# EAGLE design meca_2k10 (EAGLE 5.06)
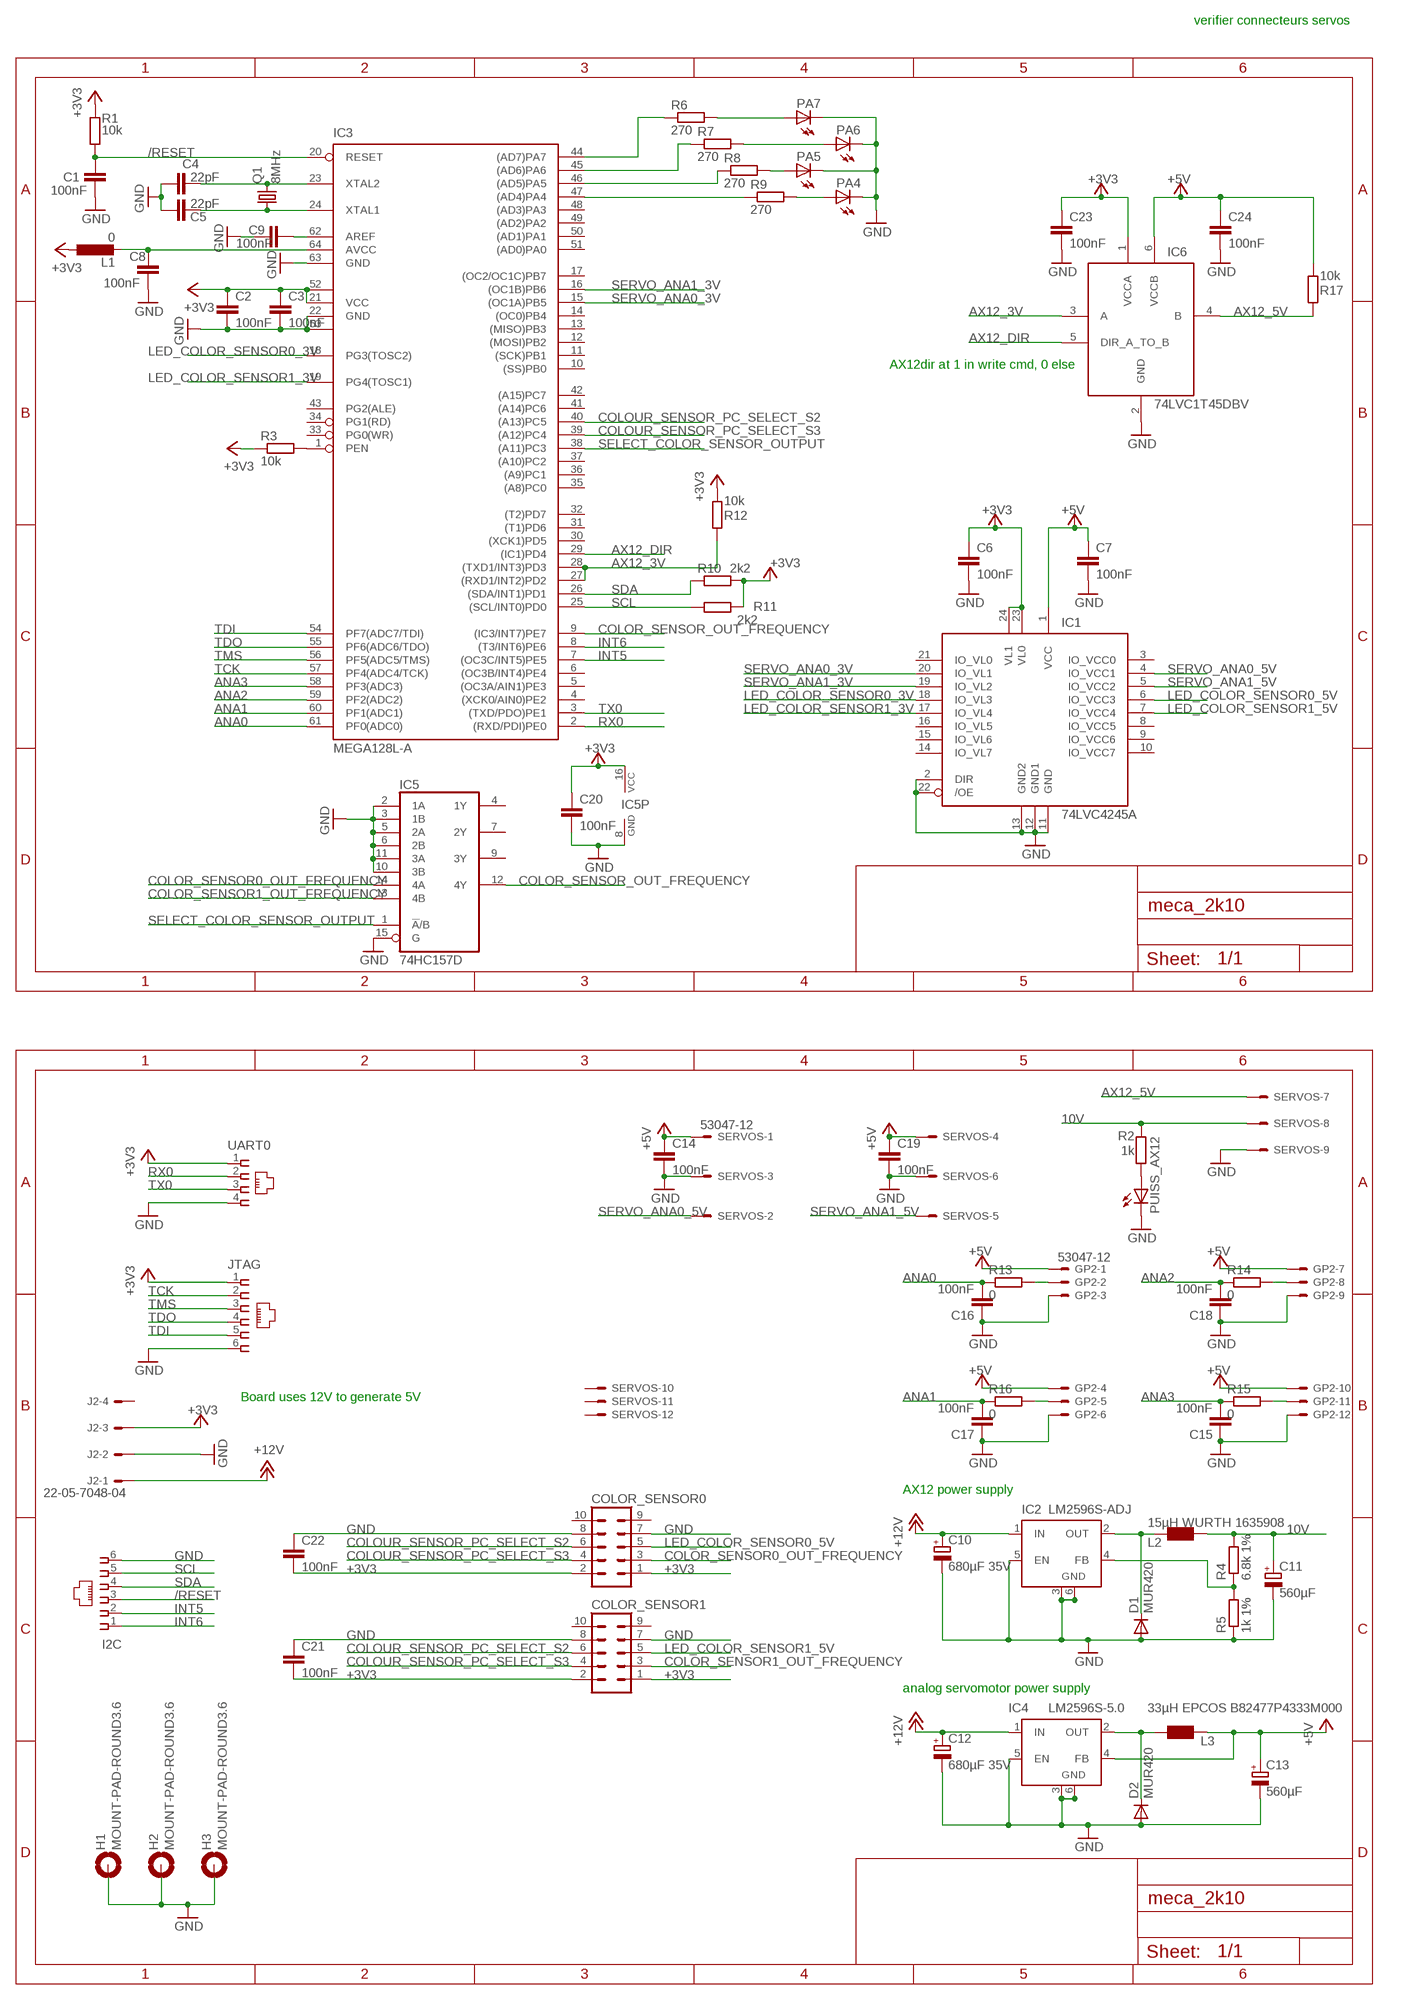
[diagram p0: schematic, sheet 1]

## Parts
C1  100nF  C-EU025-025X050  [C025-025X050]
C2  100nF  C-EUC0805  [C0805]
C3  100nF  C-EUC0805  [C0805]
C4  22pF  C-EUC0805  [C0805]
C5  22pF  C-EUC0805  [C0805]
C6  100nF  C-EU025-030X050  [C025-030X050]
C7  100nF  C-EU025-030X050  [C025-030X050]
C8  100nF  C-EUC0805  [C0805]
C9  100nF  C-EUC0805  [C0805]
C10  680µF 35V  CPOL-EUE5-10.5  [E5-10,5]
C11  560µF  CPOL-EUE5-10.5  [E5-10,5]
C12  680µF 35V  CPOL-EUE5-10.5  [E5-10,5]
C13  560µF  CPOL-EUE5-10.5  [E5-10,5]
C14  100nF  C-EU025-024X044  [C025-024X044]
C15  100nF  C-EUC0603  [C0603]
C16  100nF  C-EUC0603  [C0603]
C17  100nF  C-EUC0603  [C0603]
C18  100nF  C-EUC0603  [C0603]
C19  100nF  C-EU025-024X044  [C025-024X044]
C20  100nF  C-EUC0805  [C0805]
C21  100nF  C-EU050-025X075  [C050-025X075]
C22  100nF  C-EU050-025X075  [C050-025X075]
C23  100nF  C-EUC0603  [C0603]
C24  100nF  C-EUC0603  [C0603]
COLOR_SENSOR0  ML10L  [ML10L]
COLOR_SENSOR1  ML10L  [ML10L]
D1  MUR420  DIODE-DO201-15  [DO201-15]
D2  MUR420  DIODE-DO201-15  [DO201-15]
GP2  53047-12  [53047-12]
H1  MOUNT-PAD-ROUND3.6  [3,6-PAD]
H2  MOUNT-PAD-ROUND3.6  [3,6-PAD]
H3  MOUNT-PAD-ROUND3.6  [3,6-PAD]
I2C  520250-3  [520250-3]
IC1  74LVC4245A  [TSSOP24]
IC2  LM2596S-ADJ  LM2596S  [TO263-5]
IC3  MEGA128L-A  MEGA128-A  [TQFP64]
IC4  LM2596S-5.0  LM2596S  [TO263-5]
IC5  74HC157D  [SO16]
IC6  74LVC1T45DBV  [SOT23-6]
J2  22-05-7048-04  [7395-04]
JTAG  520250-3  [520250-3]
L1  0  L-EUL1812  [L1812]
L2  15µH WURTH 1635908  WE-PD_L/XL/XXL  [WE-PD_L/XL/XXL]
L3  33µH EPCOS B82477P4333M000  WE-PD_L/XL/XXL  [WE-PD_L/XL/XXL]
PA4  LEDCHIPLED_1206  [CHIPLED_1206]
PA5  LEDCHIPLED_1206  [CHIPLED_1206]
PA6  LEDCHIPLED_1206  [CHIPLED_1206]
PA7  LEDCHIPLED_1206  [CHIPLED_1206]
PUISS_AX12  LEDCHIPLED_1206  [CHIPLED_1206]
Q1  8MHz  CRYSTALHC49S  [HC49/S]
R1  10k  R-EU_0207/10  [0207/10]
R2  1k  R-EU_R0805  [R0805]
R3  10k  R-EU_0207/10  [0207/10]
R4  6.8k 1%  R-EU_R0805  [R0805]
R5  1k 1%  R-EU_R0805  [R0805]
R6  270  R-EU_R0805  [R0805]
R7  270  R-EU_R0805  [R0805]
R8  270  R-EU_R0805  [R0805]
R9  270  R-EU_R0805  [R0805]
R10  2k2  R-EU_R0805  [R0805]
R11  2k2  R-EU_R0805  [R0805]
R12  10k  R-EU_R0805  [R0805]
R13  0  R-EU_R0805  [R0805]
R14  0  R-EU_R0805  [R0805]
R15  0  R-EU_R0805  [R0805]
R16  0  R-EU_R0805  [R0805]
R17  10k  R-EU_R0805  [R0805]
SERVOS  53047-12  [53047-12]
UART0  555165-2  [555165-2]

## Nets
10V: C11.+ L2.1 R2.2 R4.2 SERVOS.8
+3V3: C2.1 C3.1 C6.1 C20.1 C21.2 C22.2 C23.1 COLOR_SENSOR0.1 COLOR_SENSOR0.2 COLOR_SENSOR1.1 COLOR_SENSOR1.2 IC1.23(VL0) IC1.24(VL1) IC3.21(VCC) IC3.52(VCC1) IC5.16(VCC) IC6.1(VCCA) J2.3 JTAG.1 L1.1 R1.2 R3.1 R10.1 R11.1 R12.1 UART0.1
+5V: C7.1 C13.+ C14.1 C19.1 C24.1 GP2.1 GP2.4 GP2.7 GP2.10 IC1.1(VCC) IC4.4(FB) IC6.6(VCCB) L3.1 R17.1 SERVOS.1 SERVOS.4
+12V: C10.+ C12.+ IC2.1(IN) IC4.1(IN) J2.1
/RESET: C1.1 I2C.3 IC3.20(RESET) R1.1
ANA0: C16.2 IC3.61(PF0(ADC0)) R13.1
ANA1: C17.2 IC3.60(PF1(ADC1)) R16.1
ANA2: C18.2 IC3.59(PF2(ADC2)) R14.1
ANA3: C15.2 IC3.58(PF3(ADC3)) R15.1
AX12_3V: IC3.27((RXD1/INT2)PD2) IC3.28((TXD1/INT3)PD3) IC6.3(A) R12.2
AX12_5V: IC6.4(B) R17.2 SERVOS.7
AX12_DIR: IC3.29((IC1)PD4) IC6.5(DIR_A_TO_B)
COLOR_SENSOR0_OUT_FREQUENCY: COLOR_SENSOR0.3 IC5.14(4A)
COLOR_SENSOR1_OUT_FREQUENCY: COLOR_SENSOR1.3 IC5.13(4B)
COLOR_SENSOR_OUT_FREQUENCY: IC3.9((IC3/INT7)PE7) IC5.12(4Y)
COLOUR_SENSOR_PC_SELECT_S2: COLOR_SENSOR0.6 COLOR_SENSOR1.6 IC3.40((A13)PC5)
COLOUR_SENSOR_PC_SELECT_S3: COLOR_SENSOR0.4 COLOR_SENSOR1.4 IC3.39((A12)PC4)
GND: C1.2 C2.2 C3.2 C4.1 C5.1 C6.2 C7.2 C8.2 C9.1 C10.- C11.- C12.- C13.- C14.2 C15.1 C16.1 C17.1 C18.1 C19.2 C20.2 C21.1 C22.1 C23.2 C24.2 COLOR_SENSOR0.7 COLOR_SENSOR0.8 COLOR_SENSOR1.7 COLOR_SENSOR1.8 D1.A D2.A GP2.3 GP2.6 GP2.9 GP2.12 H1.B3,6(MOUNT) H2.B3,6(MOUNT) H3.B3,6(MOUNT) I2C.6 IC1.2(DIR) IC1.11(GND) IC1.12(GND1) IC1.13(GND2) IC1.22(/OE) IC2.3(GND) IC2.5(EN) IC2.6(GND) IC3.22(GND) IC3.53(GND1) IC3.63(GND) IC4.3(GND) IC4.5(EN) IC4.6(GND) IC5.2(1A) IC5.3(1B) IC5.5(2A) IC5.6(2B) IC5.8(GND) IC5.10(3B) IC5.11(3A) IC5.15(G) IC6.2(GND) J2.2 JTAG.6 PA4.C PA5.C PA6.C PA7.C PUISS_AX12.C R5.1 SERVOS.3 SERVOS.6 SERVOS.9 UART0.4
INT5: I2C.2 IC3.7((OC3C/INT5)PE5)
INT6: I2C.1 IC3.8((T3/INT6)PE6)
LED_COLOR_SENSOR0_3V: IC1.18(IO_VL3) IC3.18(PG3(TOSC2))
LED_COLOR_SENSOR0_5V: COLOR_SENSOR0.5 IC1.6(IO_VCC3)
LED_COLOR_SENSOR1_3V: IC1.17(IO_VL4) IC3.19(PG4(TOSC1))
LED_COLOR_SENSOR1_5V: COLOR_SENSOR1.5 IC1.7(IO_VCC4)
N$1: C4.2 IC3.23(XTAL2) Q1.2
N$2: C5.2 IC3.24(XTAL1) Q1.1
N$3: IC3.47((AD4)PA4) R9.1
N$4: IC3.1(PEN) R3.2
N$5: C8.1 IC3.64(AVCC) L1.2
N$6: C9.2 IC3.62(AREF)
N$7: GP2.11 R15.2
N$8: D1.C IC2.2(OUT) L2.2
N$9: IC2.4(FB) R4.1 R5.2
N$10: IC3.46((AD5)PA5) R8.1
N$11: D2.C IC4.2(OUT) L3.2
N$12: GP2.2 R13.2
N$13: GP2.5 R16.2
N$14: PUISS_AX12.A R2.1
N$15: GP2.8 R14.2
N$17: IC3.45((AD6)PA6) R7.1
N$18: PA4.A R9.2
N$19: PA5.A R8.2
N$20: PA6.A R7.2
N$21: PA7.A R6.2
N$22: IC3.44((AD7)PA7) R6.1
RX0: IC3.2((RXD/PDI)PE0) UART0.2
SCL: I2C.5 IC3.25((SCL/INT0)PD0) R11.2
SDA: I2C.4 IC3.26((SDA/INT1)PD1) R10.2
SELECT_COLOR_SENSOR_OUTPUT: IC3.38((A11)PC3) IC5.1(!A!/B)
SERVO_ANA0_3V: IC1.20(IO_VL1) IC3.15((OC1A)PB5)
SERVO_ANA0_5V: IC1.4(IO_VCC1) SERVOS.2
SERVO_ANA1_3V: IC1.19(IO_VL2) IC3.16((OC1B)PB6)
SERVO_ANA1_5V: IC1.5(IO_VCC2) SERVOS.5
TCK: IC3.57(PF4(ADC4/TCK)) JTAG.2
TDI: IC3.54(PF7(ADC7/TDI)) JTAG.5
TDO: IC3.55(PF6(ADC6/TDO)) JTAG.4
TMS: IC3.56(PF5(ADC5/TMS)) JTAG.3
TX0: IC3.3((TXD/PDO)PE1) UART0.3
Unconnected: COLOR_SENSOR0.9 COLOR_SENSOR0.10 COLOR_SENSOR1.9 COLOR_SENSOR1.10 IC1.3(IO_VCC0) IC1.8(IO_VCC5) IC1.9(IO_VCC6) IC1.10(IO_VCC7) IC1.14(IO_VL7) IC1.15(IO_VL6) IC1.16(IO_VL5) IC1.21(IO_VL0) IC3.4((XCK0/AIN0)PE2) IC3.5((OC3A/AIN1)PE3) IC3.6((OC3B/INT4)PE4) IC3.10((SS)PB0) IC3.11((SCK)PB1) IC3.12((MOSI)PB2) IC3.13((MISO)PB3) IC3.14((OC0)PB4) IC3.17((OC2/OC1C)PB7) IC3.30((XCK1)PD5) IC3.31((T1)PD6) IC3.32((T2)PD7) IC3.33(PG0(WR)) IC3.34(PG1(RD)) IC3.35((A8)PC0) IC3.36((A9)PC1) IC3.37((A10)PC2) IC3.41((A14)PC6) IC3.42((A15)PC7) IC3.43(PG2(ALE)) IC3.48((AD3)PA3) IC3.49((AD2)PA2) IC3.50((AD1)PA1) IC3.51((AD0)PA0) IC5.4(1Y) IC5.7(2Y) IC5.9(3Y) J2.4 SERVOS.10 SERVOS.11 SERVOS.12

## Notes on the sheet
- verifier connecteurs servos
- AX12dir at 1 in write cmd, 0 else
- Board uses 12V to generate 5V
- AX12 power supply
- analog servomotor power supply

## Library data of the parts
C1-C9 C14-C24 = rcl:C-EU: CAPACITOR, European symbol
C10-C13 = rcl:CPOL-EU: POLARIZED CAPACITOR, European symbol
COLOR_SENSOR0 COLOR_SENSOR1 = con-harting-ml:ML10: HARTING
D1 D2 = diode:DIODE-: DIODE
GP2 SERVOS = con-molex:53?-12: CONNECTOR wire to board 1.25 mm (.049 inch) pitch header
H1-H3 = holes:MOUNT-PAD-ROUND: MOUNTING PAD, round
I2C JTAG = con-amp:520250-3: AMP connector
IC1 = robotter:74LVC4245: octal transceiver buffer
IC2 IC4 = linear:LM2596S: STEP-DOWN VOLTAGE REGULATOR
IC3 = atmel:MEGA128: MICROCONTROLLER 128 Kbytes FLASH 4 Kbytes SRAM 4 Kbytes EEPROM DUAL USART 8-channel 10 bit ADC Source: avr.lbr
IC5 = 74xx-eu:74*157: Quadruple 2-line to 1-line data SELECTOR/MULTIPLEXER
IC6 = robotter:74LVC1T45
J2 = con-molex:22-?-04: CONNECTOR wire to board 2.54 mm (.1 inch) pitch header
L1 = rcl:L-EU: INDUCTOR, European symbol
L2 L3 = wuerth-elektronik:WE-PD: SMD-Shielded Power Inductors WE-PD Is recommended for the application with switching regulators from National Semiconductor, Linear Technology, Texas Instruments and Fairchild Semiconductor - Magnetically shielded version which results in a low leakage field - High storage capacity - Low self-losses -- Switching regulators with low operating voltages (computer, laptop, mobile phones, pagers) -- Integrated DC/DC-converter
PA4-PA7 PUISS_AX12 = led:LED: LED OSRAM: - CHIPLED LG R971, LG N971, LY N971, LG Q971, LY Q971, LO R971, LY R971 LH N974, LH R974 LS Q976, LO Q976, LY Q976 LO Q996 - Hyper CHIPLED LW Q18S LB Q993, LB Q99A, LB R99A - SideLED LS A670, LO A670, LY A670, LG A670, LP A670 LB A673, LV A673, LT A673, LW A673 LH A674 LY A675 LS A676, LA A676, LO A676, LY A676, LW A676 LS A679, LY A679, LG A679 - Hyper Micro SIDELED® LS Y876, LA Y876, LO Y876, LY Y876 LT Y87S - SmartLED LW L88C, LW L88S LB L89C, LB L89S, LG L890 LS L89K, LO L89K, LY L89K LS L896, LA L896, LO L896, LY L896 - TOPLED LS T670, LO T670, LY T670, LG T670, LP T670 LSG T670, LSP T670, LSY T670, LOP T670, LYG T670 LG T671, LOG T671, LSG T671 LB T673, LV T673, LT T673, LW T673 LH T674 LS T676, LA T676, LO T676, LY T676, LB T676, LH T676, LSB T676, LW T676 LB T67C, LV T67C, LT T67C, LS T67K, LO T67K, LY T67K, LW E67C LS E67B, LA E67B, LO E67B, LY E67B, LB E67C, LV E67C, LT E67C LW T67C LS T679, LY T679, LG T679 LS T770, LO T770, LY T770, LG T770, LP T770 LB T773, LV T773, LT T773, LW T773 LH T774 LS E675, LA E675, LY E675, LS T675 LS T776, LA T776, LO T776, LY T776, LB T776 LHGB T686 LT T68C, LB T68C - Hyper Mini TOPLED® LB M676 - Mini TOPLED Santana® LG M470 LS M47K, LO M47K, LY M47K Source: http://www.osram.convergy.de LUXEON: - LUMILED® LXK2-PW12-R00, LXK2-PW12-S00, LXK2-PW14-U00, LXK2-PW14-V00 LXK2-PM12-R00, LXK2-PM12-S00, LXK2-PM14-U00 LXK2-PE12-Q00, LXK2-PE12-R00, LXK2-PE12-S00, LXK2-PE14-T00, LXK2-PE14-U00 LXK2-PB12-K00, LXK2-PB12-L00, LXK2-PB12-M00, LXK2-PB14-N00, LXK2-PB14-P00, LXK2-PB14-Q00 LXK2-PR12-L00, LXK2-PR12-M00, LXK2-PR14-Q00, LXK2-PR14-R00 LXK2-PD12-Q00, LXK2-PD12-R00, LXK2-PD12-S00 LXK2-PH12-R00, LXK2-PH12-S00 LXK2-PL12-P00, LXK2-PL12-Q00, LXK2-PL12-R00 Source: www.luxeon.com KINGBRIGHT: KA-3528ASYC Source: www.kingbright.com
Q1 = crystal:CRYSTAL: CRYSTAL
R1-R17 = rcl:R-EU_: RESISTOR, European symbol
UART0 = con-amp:555165-2: AMP connector

## Board
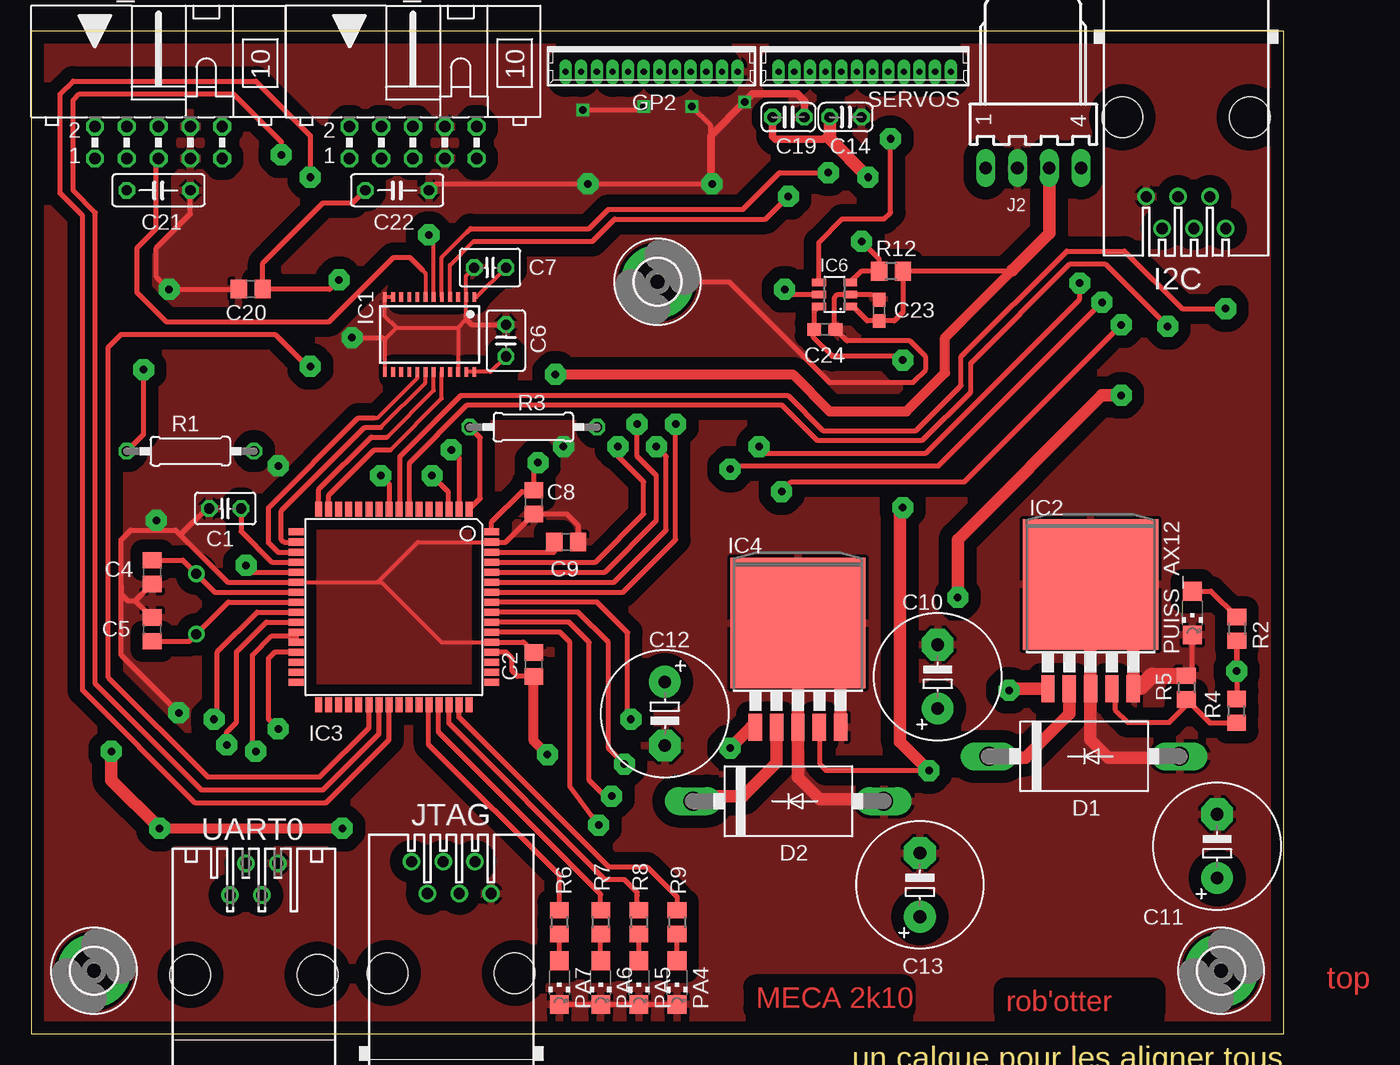
[diagram p1: board, top side]
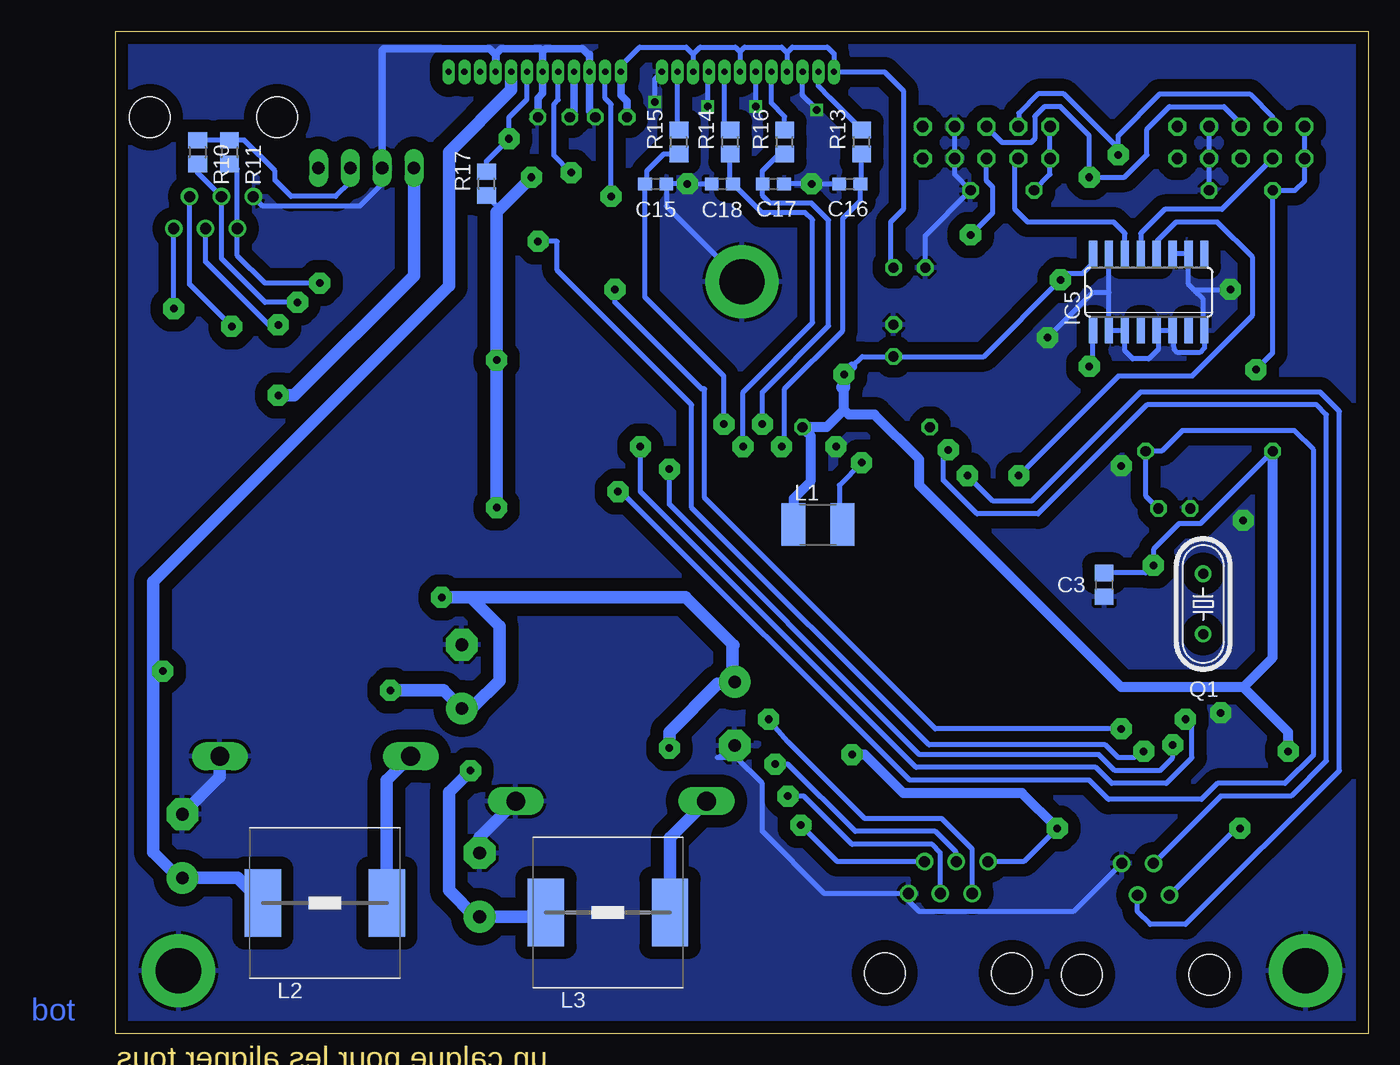
[diagram p2: board, bottom side, seen from below]

Size 100 x 80 mm. Coordinates in mm from the lower left corner, seen from the top.
Outline: 0,0 100,0 100,80 0,80 0,0
Copper layers (1*16): Top 0.035mm / dielectric 1.5mm / Bottom 0.035mm
Design rules "default *": minimum track width 10mil, minimum drill 0.0152mm, track to track 1mm, track to pad 1mm, pad to pad 1mm, via to via 8mil, smd to smd 8mil, copper to edge 1mm, drill to drill 8mil, minimum pad ring 10mil, minimum via ring 8mil, stop-mask expansion 4mil, vias tented up to drill 0mil, thermal gap 10mil

### Footprints (pad centres in the part's own frame; a part is rotated, then mirrored left to right if it is on the bottom)
C025-025X050 = drill 0.813 octagon: 1 -1.27,0; 2 1.27,0
C0805 = smd 1.3 x 1.5: 1 -0.95,0; 2 0.95,0
C025-030X050 = drill 0.813 octagon: 1 -1.27,0; 2 1.27,0
E5-10,5 = drill 1.016 pad 2.54 round: + -2.54,0 | drill 1.016 pad 2.54 octagon: - 2.54,0
C025-024X044 = drill 0.813 octagon: 1 -1.27,0; 2 1.27,0
C0603 = smd 1.1 x 1: 1 -0.85,0; 2 0.85,0
C050-025X075 = drill 0.813 octagon: 1 -2.54,0; 2 2.54,0
ML10L = drill 0.914 octagon: 1 -5.08,-1.27; 2 -5.08,1.27; 3 -2.54,-1.27; 4 -2.54,1.27; 5 0,-1.27; 6 0,1.27; 7 2.54,-1.27; 8 2.54,1.27; 9 5.08,-1.27; 10 5.08,1.27
DO201-15 = drill 1.499 long: A 7.62,0; C -7.62,0
53047-12 = drill 0.5 pad 0.698 long: 1 6.875,0.45; 2 5.625,0.45; 3 4.375,0.45; 4 3.125,0.45; 5 1.875,0.45; 6 0.625,0.45; 7 -0.625,0.45; 8 -1.875,0.45; 9 -3.125,0.45; 10 -4.375,0.45; 11 -5.625,0.45; 12 -6.875,0.45
3,6-PAD = drill 3.6 pad 5.842 round: B3,6 0,0
520250-3 = drill 0.889 round: 1 -3.175,8.89; 2 -1.905,6.35; 3 -0.635,8.89; 4 0.635,6.35; 5 1.905,8.89; 6 3.175,6.35 | hole 3.251: -5.08,0; 5.08,0
TSSOP24 = smd 0.3 x 0.75: 1 -3.575,-3; 2 -2.925,-3; 3 -2.275,-3; 4 -1.625,-3; 5 -0.975,-3; 6 -0.325,-3; 7 0.325,-3; 8 0.975,-3; 9 1.625,-3; 10 2.275,-3; 11 2.925,-3; 12 3.575,-3; 13 3.575,3; 14 2.925,3; 15 2.275,3; 16 1.625,3; 17 0.975,3; 18 0.325,3; 19 -0.325,3; 20 -0.975,3; 21 -1.625,3; 22 -2.275,3; 23 -2.925,3; 24 -3.575,3
TO263-5 = smd 1.067 x 2.159: 1 -3.404,-5.791; 2 -1.702,-5.791; 3 0,-5.791; 4 1.702,-5.791; 5 3.404,-5.791 | smd 10.8 x 10.41: 6 0,2.54
TQFP64 = smd 1.194 x 0.559: 1 -7.8,6; 2 -7.8,5.2; 3 -7.8,4.4; 4 -7.8,3.6; 5 -7.8,2.8; 6 -7.8,2; 7 -7.8,1.2; 8 -7.8,0.4; 9 -7.8,-0.4; 10 -7.8,-1.2; 11 -7.8,-2; 12 -7.8,-2.8; 13 -7.8,-3.6; 14 -7.8,-4.4; 15 -7.8,-5.2; 16 -7.8,-6; 33 7.8,-6; 34 7.8,-5.2; 35 7.8,-4.4; 36 7.8,-3.6; 37 7.8,-2.8; 38 7.8,-2; 39 7.8,-1.2; 40 7.8,-0.4; 41 7.8,0.4; 42 7.8,1.2; 43 7.8,2; 44 7.8,2.8; 45 7.8,3.6; 46 7.8,4.4; 47 7.8,5.2; 48 7.8,6 | smd 0.559 x 1.194: 17 -6,-7.8; 18 -5.2,-7.8; 19 -4.4,-7.8; 20 -3.6,-7.8; 21 -2.8,-7.8; 22 -2,-7.8; 23 -1.2,-7.8; 24 -0.4,-7.8; 25 0.4,-7.8; 26 1.2,-7.8; 27 2,-7.8; 28 2.8,-7.8; 29 3.6,-7.8; 30 4.4,-7.8; 31 5.2,-7.8; 32 6,-7.8; 49 6,7.8; 50 5.2,7.8; 51 4.4,7.8; 52 3.6,7.8; 53 2.8,7.8; 54 2,7.8; 55 1.2,7.8; 56 0.4,7.8; 57 -0.4,7.8; 58 -1.2,7.8; 59 -2,7.8; 60 -2.8,7.8; 61 -3.6,7.8; 62 -4.4,7.8; 63 -5.2,7.8; 64 -6,7.8
SO16 = smd 0.66 x 2.032: 1 -4.445,-3.073; 2 -3.175,-3.073; 3 -1.905,-3.073; 4 -0.635,-3.073; 5 0.635,-3.073; 6 1.905,-3.073; 7 3.175,-3.073; 8 4.445,-3.073; 9 4.445,3.073; 10 3.175,3.073; 11 1.905,3.073; 12 0.635,3.073; 13 -0.635,3.073; 14 -1.905,3.073; 15 -3.175,3.073; 16 -4.445,3.073
SOT23-6 = smd 0.6 x 1.1: 1 -0.95,-1.25; 2 0,-1.25; 3 0.95,-1.25; 4 0.95,1.25; 5 0,1.25; 6 -0.95,1.25
7395-04 = drill 1.016 long: 1 3.81,0; 2 1.27,0; 3 -1.27,0; 4 -3.81,0
L1812 = smd 1.9 x 3.4: 1 -1.95,0; 2 1.95,0
WE-PD_L/XL/XXL = smd 2.9 x 5.4: 1 -4.95,0; 2 4.95,0
CHIPLED_1206 = smd 1.5 x 1.5: A 0,-1.75; C 0,1.75
HC49/S = drill 0.813 round: 1 -2.413,0; 2 2.413,0
0207/10 = drill 0.813 octagon: 1 -5.08,0; 2 5.08,0
R0805 = smd 1.3 x 1.5: 1 -0.95,0; 2 0.95,0
555165-2 = drill 0.889 round: 1 -1.905,5.207; 2 -0.635,7.747; 3 0.635,5.207; 4 1.905,7.747 | hole 3.251: -5.08,-1.143; 5.08,-1.143

### Placement (x,y rotation side)
C1  15.48,41.91 180 top
C2  40.12,29.46 90 top
C3  21.08,35.81 270 bottom
C4  9.65,36.83 90 top
C5  9.65,32.26 270 top
C6  37.9,55.31 90 top
C7  36.63,61.14 180 top
C8  40.13,42.42 270 top
C9  42.72,39.24 180 top
C10  72.38,28.49 90 top
C11  94.69,14.96 90 top
C12  50.59,25.53 270 top
C13  70.96,11.87 90 top
C14  65.02,73.15 0 top
C15  56.9,67.82 180 bottom
C16  41.39,67.82 0 bottom
C17  47.5,67.82 180 bottom
C18  51.56,67.82 0 bottom
C19  60.45,73.15 0 top
C20  17.53,59.44 180 top
C21  10.16,67.31 180 top
C22  29.21,67.31 180 top
C23  67.69,57.73 90 top
C24  63.37,56.21 0 top
COLOR_SENSOR0  30.48,71.12 0 top
COLOR_SENSOR1  10.16,71.12 0 top
D1  84.07,22.12 0 top
D2  60.45,18.54 0 top
GP2  49.53,77.21 180 top
H1  5,5 0 top
H2  50,60 0 top
H3  95,5 0 top
I2C  92.2,73.15 180 top
IC1  31.81,55.81 180 top
IC2  84.58,33.3 0 top
IC3  28.96,34.04 270 top
IC4  61.22,30.23 0 top
IC5  17.53,59.18 0 bottom
IC6  64.13,59 90 top
J2  80.01,69.09 180 top
JTAG  33.53,4.83 0 top
L1  43.93,40.63 0 bottom
L2  83.31,10.41 0 bottom
L3  60.71,9.65 0 bottom
PA4  51.56,4.07 180 top
PA5  48.51,4.07 180 top
PA6  45.47,4.07 180 top
PA7  42.16,4.07 180 top
PUISS_AX12  92.71,33.57 180 top
Q1  13.17,34.29 90 bottom
R1  12.7,46.48 180 top
R2  96.27,32.3 270 top
R3  40.09,48.41 180 top
R4  96.24,25.75 90 top
R5  92.23,27.61 270 top
R6  42.16,8.89 270 top
R7  45.47,8.89 270 top
R8  48.51,8.89 270 top
R9  51.56,8.89 270 top
R10  93.47,70.36 270 bottom
R11  90.93,70.36 270 bottom
R12  68.65,60.84 180 top
R13  40.45,71.17 90 bottom
R14  50.94,71.17 90 bottom
R15  55.04,71.17 90 bottom
R16  46.59,71.17 90 bottom
R17  70.4,67.84 90 bottom
SERVOS  66.55,77.21 180 top
UART0  17.78,5.84 0 top

### Tracks (layer width: path | path; a pad name or v marks a point on that pad's centre or on a via)
10V  (via drill 0.6 pad 1.68)
  Top 0.406: R4.2 96.27,26.73 R2.2 v96.27,28.94 v96.26,28.93
  Bottom 0.406: v96.26,28.93 96.77,28.93 97.03,28.67
  Bottom 0.61: SERVOS.8 68.42,75.85
  Bottom 1.016: SERVOS.8 68.42,75.34 73.41,70.36 73.41,59.69 97.03,36.07 97.03,28.67 97.03,14.48 95.27,12.72 C11.+ 90.27,12.42 L2.1
+3V3  (via drill 0.6 pad 1.68)
  Top 0.305: IC1.23 IC1.24 36.67,52.81 C6.1
  Top 0.406: IC6.1 65.59,58.05 66.76,56.88 C23.1 68.91,56.88 69.6,57.56 R12.1 78.25,60.84 78.34,60.93 | v24.58,60.16 23.81,59.39 18.52,59.39 C20.1 18.48,61.48 23.3,66.3 25.66,66.3 C22.2 | IC3.21 17.69,36.84 v17.15,37.38 | IC3.52 37.92,30.44 38.4,29.95 38.4,28.93 38.82,28.51 C2.1 | v8.96,52.99 8.96,47.82 R1.2
  Top 0.813: 78.34,60.93 72.96,55.55 72.96,52.74 69.89,49.66 63.74,49.66 60.8,52.61 v41.86,52.61 | v10.24,16.38 v24.83,16.38 | C2.1 40.12,23.37 v41.22,22.27
  Top 1.016: J2.3 81.28,63.87 78.34,60.93 | v10.24,16.38 6.4,20.22 v6.4,22.53
  Bottom 0.406: R10.1 R11.1 89.74,71.31 87.3,68.86 87.3,68.1 86.02,66.82 82.43,66.82 81.28,67.97 J2.3 | COLOR_SENSOR0.2 COLOR_SENSOR0.1 25.4,68.58 C22.2 | COLOR_SENSOR1.2 COLOR_SENSOR1.1 5.08,68.07 5.84,67.31 C21.2 7.62,54.33 v8.96,52.99 | IC5.16 21.97,61.48 22.78,60.67 24.06,60.67 v24.58,60.16 30.7,54.04 C6.1 40.42,54.04 41.22,53.25 | C3.1 17.76,36.76 v17.15,37.38 17.15,38.66 15.1,40.7 13.4,40.7 R1.2 | UART0.1 10.54,16.38 v10.24,16.38 | JTAG.1 27.5,13.72 v24.83,16.38 | R3.1 44.8,48.04
  Bottom 0.813: v41.86,52.61 41.22,53.25 | 44.8,48.04 44.54,47.78 44.54,44.03 45.88,42.69 L1.1 | R1.2 7.62,30.01 9.98,27.65 | 41.86,49.79 41.86,51.58 | 9.98,27.65 18.43,27.65 19.71,27.65 35.84,43.78 35.84,45.82 39.42,49.41 41.47,49.41 41.86,49.79 | v6.4,22.53 6.4,24.06 9.98,27.65 | 41.86,49.79 43.24,48.41 R3.1 | v24.83,16.38 27.65,19.2 37.12,19.2 40.19,22.27 v41.22,22.27
  Bottom 1.016: v41.86,52.61 41.86,51.58 41.99,51.58
+5V  (via drill 0.6 pad 1.68)
  Top 0.305: IC1.1 35.57,58.81 C7.1
  Top 0.406: IC6.6 62.52,57.69 C24.1 62.46,56.15 62.46,55.55 63.96,54.05 69.6,54.05 v69.6,53.76 | IC4.4 62.98,24.38 62.98,21.5 63.49,20.99 v71.68,20.99
  Top 0.61: C14.1 63.75,71.88 63.25,71.37 59.44,71.37 59.18,71.63 C19.1
  Top 1.016: v66.82,68.35 63.75,71.41 C14.1 | v69.6,41.98 69.38,41.76 69.38,23.3 v71.68,20.99
  Bottom 0.406: 46.41,78.31 GP2.4 | 46.41,78.31 45.97,78.74 43.18,78.74 42.66,78.22 GP2.1 38.62,76.76 37.12,75.26 37.12,65.79 38.14,64.77 38.14,61.38 C7.1 | 50.16,78.37 GP2.7 | 50.16,78.37 49.78,78.74 46.84,78.74 46.41,78.31 | 53.91,78.17 GP2.10 | 53.91,78.17 53.34,78.74 50.53,78.74 50.16,78.37 | SERVOS.1 59.67,77.23 58.17,78.74 54.47,78.74 53.91,78.17 | 69.6,65.57 69.6,66.09 R17.1
  Bottom 0.61: SERVOS.1 59.67,74.91 59.18,74.42 C19.1 | SERVOS.4 63.42,73.48 C14.1
  Bottom 1.016: v66.82,68.35 69.6,65.57 v69.6,53.76 v69.6,41.98 | v71.68,20.99 73.41,19.27 73.41,11.43 71.3,9.33 C13.+ 65.66,9.33 L3.1
+12V  (via drill 0.6 pad 1.68)
  Top 1.016: v87.04,50.94 85.5,50.94 73.98,39.42 v73.98,34.82 | IC2.1 78.2,27.51 v78.08,27.39 | IC4.1 57.46,24.43 v55.81,22.78
  Bottom 1.016: J2.1 76.2,60.5 85.76,50.94 v87.04,50.94 | v78.08,27.39 73.82,27.39 C10.+ 72.21,26.11 71.42,26.11 69.38,28.16 69.38,32.51 71.68,34.82 v73.98,34.82 54.53,34.82 50.69,30.98 50.75,30.91 50.75,27.9 | v55.81,22.78 55.81,24.06 51.97,27.9 50.75,27.9 | 50.75,27.9 C12.+
/RESET  (via drill 0.6 pad 1.68)
  Top 0.406: IC3.20 19.2,37.64 16.75,40.08 C1.1 | v87.04,56.58 74.5,44.03 60.67,44.03 v59.9,43.26
  Bottom 0.406: I2C.3 92.84,61.59 87.82,56.58 v87.04,56.58 | C1.1 17.78,42.94 R1.1 16.49,46.48 14.85,48.13 5.89,48.13 4.35,46.59 4.35,22.27 6.66,19.97 12.03,19.97 13.31,18.69 20.74,18.69 22.27,20.22 36.61,20.22 59.65,43.26 v59.9,43.26
ANA0  (via drill 0.6 pad 1.68)
  Top 0.406: IC3.61 45.06,37.64 48.9,41.47 48.9,44.03 46.85,46.08 v46.85,46.85
  Bottom 0.406: v46.85,46.85 46.59,47.1 46.59,51.46 41.95,56.1 41.95,65.06 40.54,66.47 C16.2 40.45,67.91 R13.1
ANA1  (via drill 0.6 pad 1.68)
  Top 0.406: IC3.60 45.8,36.84 49.92,40.96 49.92,44.54 48.38,46.08 v48.38,48.64
  Bottom 0.406: v48.38,48.64 48.38,51.2 43.1,56.49 43.1,64.94 44.45,66.29 47.75,66.29 48.35,66.89 C17.2 48.38,67.85 48.38,68.86 47.1,70.14 R16.1
ANA2  (via drill 0.6 pad 1.68)
  Top 0.406: IC3.59 46.53,36.04 50.69,40.19 50.69,46.08 v49.92,46.85
  Bottom 0.406: v49.92,46.85 49.92,51.2 44.37,56.75 44.37,64.94 44.96,65.53 48.43,65.53 C18.2 50.94,68.05 R14.1
ANA3  (via drill 0.6 pad 1.68)
  Top 0.406: IC3.58 47.27,35.24 51.46,39.42 v51.46,48.64
  Bottom 0.406: v51.46,48.64 51.46,52.48 57.75,58.77 C15.2 57.6,67.97 57.6,68.86 56.25,70.22 R15.1
AX12_3V  (via drill 0.6 pad 1.68)
  Top 0.406: IC3.28 IC3.27 21.16,31.74 19.2,31.74 17.66,30.21 17.66,22.78 v17.92,22.53 | IC6.3 66.27,60.84 R12.2 67.7,61.84 v66.3,63.23
  Bottom 0.406: v17.92,22.53 18.69,22.02 19.97,22.02 20.99,23.04 35.07,23.04 54.02,41.98 54.02,50.18 64.77,60.93 64.77,63.23 v66.3,63.23
AX12_5V  (via drill 0.6 pad 1.68)
  Top 0.406: v68.61,71.42 68.61,65.54 68.1,65.02 64.77,65.02 62.88,63.14 IC6.4
  Bottom 0.406: SERVOS.7 67.17,74.56 68.61,73.12 v68.61,71.42 70.4,69.63 R17.2
AX12_DIR  (via drill 0.6 pad 1.68)
  Top 0.406: IC3.29 21.13,30.46 19.46,30.46 18.94,29.95 18.94,25.09 v19.71,24.32 | v60.16,59.39 60.54,59 IC6.5
  Bottom 0.406: v19.71,24.32 34.56,24.32 52.99,42.75 52.99,51.46 53.25,51.46 60.16,58.37 v60.16,59.39
COLOR_SENSOR0_OUT_FREQUENCY
  Bottom 0.406: IC5.14 19.43,63.88 20.32,64.77 27.18,64.77 28.19,65.79 28.19,69.6 COLOR_SENSOR0.3
COLOR_SENSOR1_OUT_FREQUENCY
  Bottom 0.406: COLOR_SENSOR1.3 11.68,65.79 16.26,65.79 18.16,63.88 IC5.13
COLOR_SENSOR_OUT_FREQUENCY  (via drill 0.6 pad 1.68)
  Top 0.406: IC3.9 28.56,43.89 v27.9,44.54
  Bottom 0.406: IC5.12 16.9,63.23 15.36,64.77 12.03,64.77 9.22,61.95 9.22,57.34 14.08,52.48 19.97,52.48 v27.9,44.54
COLOUR_SENSOR_PC_SELECT_S2  (via drill 0.6 pad 1.68)
  Top 0.406: IC3.40 28.56,23.44 23.55,18.43 13.06,18.43 4.1,27.39 4.1,65.28 2.3,67.07 2.3,75.01 3.33,76.03 17.92,76.03 22.27,71.68 v22.27,68.35
  Bottom 0.406: COLOR_SENSOR0.6 29.21,71.12 26.93,71.12 26.62,71.42 26.62,73.22 25.86,73.98 24.58,73.98 22.27,71.68 v22.27,68.35 19.46,68.35 17.66,70.14 17.66,72.19 15.87,73.98 | COLOR_SENSOR1.6 10.16,72.62 11.52,73.98 15.87,73.98 | 15.87,73.98 17.41,72.45
COLOUR_SENSOR_PC_SELECT_S3  (via drill 0.6 pad 1.68)
  Top 0.406: IC3.39 27.76,23.92 23.3,19.46 13.57,19.46 5.12,27.9 5.12,65.54 3.33,67.33 3.33,74.5 3.84,75.01 16.13,75.01 19.97,71.17 v19.97,70.14
  Bottom 0.406: 7.62,72.9 COLOR_SENSOR1.4 7.62,73.16 9.47,75.01 16.64,75.01 19.97,71.68 19.97,70.66 | COLOR_SENSOR0.4 27.9,72.43 27.9,73.47 26.37,75.01 24.32,75.01 19.97,70.66 | v19.97,70.14 19.97,70.66
GND  (via drill 0.6, 0.6 pad 1.68)
  Top 0.305: IC1.11 IC1.12 28.23,57.27 29.18,56.32 | 34.08,56.35 IC1.22 | 34.08,56.35 34.73,57 IC1.2 34.73,60.51 C7.2 | 34.08,56.35 34.05,56.32 29.18,56.32 | IC1.13 28.23,55.37 29.18,56.32 | IC3.22 27.65,36.04 | 27.65,36.04 27.96,36.04 32.77,31.23 IC3.53 | IC3.63 30.85,39.24 27.65,36.04
  Top 0.406: C24.2 64.13,56.3 | v54.36,67.82 v44.44,67.82 32.26,67.82 C22.1 | C20.2 16.53,59.39 v11.01,59.39 9.98,60.42 9.98,62.72 12.7,65.44 C21.1 | 34.73,57 35.15,56.58 C6.2 | 8.3,34.56 C5.1 | 8.3,34.56 7.68,34.56 7.17,35.07 7.17,35.84 | 7.17,35.84 7.17,39.42 7.94,40.19 11.52,40.19 11.9,39.81 | 11.9,39.81 15.68,36.04 IC3.22 | C4.1 9.62,35.88 8.3,34.56 | C1.2 14.01,41.91 11.9,39.81 | IC3.53 39.29,31.24 C2.2 | PA7.C PA6.C PA5.C PA4.C | 28.23,55.37 28.05,55.55 v25.6,55.55 | C9.1 43.67,40.56 42.75,41.47 40.38,41.47 C8.2 37.89,39.24 IC3.63 | PUISS_AX12.C 92.71,29.04 R5.1 | C23.2 67.12,59 IC6.2 64.39,59 64.13,58.75 64.13,56.21 C24.2 | C24.2 65.13,55.3 70.14,55.3 71.42,54.02 71.42,52.99 70.4,51.97 63.74,51.97 55.71,60 H2.B3,6 | v52.74,73.98 54.27,72.45 54.27,71.68 | v48.9,73.98 48.64,73.73 v44.03,73.73 | v11.78,25.6 7.17,30.21 7.17,35.84
  Top 0.61: C19.2 61.72,74.47 61.18,75.01 57.6,75.01 v56.96,74.37 54.27,71.68 54.27,67.91 v54.36,67.82
  Top 1.016: 88.58,27.65 88.12,27.65 IC2.5 87.99,32.44 IC2.6 IC2.3 84.58,23.45 86.02,22.02 91.59,22.02 D1.A | D2.A 67.93,18.69 62.98,18.69 61.22,20.44 IC4.3 61.22,31.27 61.97,32.02 | IC4.5 64.62,30.1 63.74,30.98 63.01,30.98 61.97,32.02 | 61.97,32.02 IC4.6
  Top 1.27: R5.1 89.49,28.56 88.58,27.65
  Bottom 0.406: 88.65,66.42 I2C.6 88.27,66.04 80.52,66.04 78.74,67.82 J2.2 | COLOR_SENSOR1.8 COLOR_SENSOR1.7 C21.1 | COLOR_SENSOR0.8 COLOR_SENSOR0.7 33.02,68.58 C22.1 35.36,63.7 C7.2 | IC5.11 15.6,62.23 14.48,62.23 14.45,62.26 IC5.10 14.35,59.82 13.88,59.34 | 13.88,59.34 13.21,58.67 13.21,56.24 IC5.8 13.08,54.74 13.46,54.36 15.24,54.36 15.49,54.61 IC5.6 IC5.5 16.76,55.98 16.76,54.61 17.53,53.85 18.8,53.85 19.43,54.48 IC5.3 IC5.2 20.7,59.14 | C17.1 v44.44,67.82 C16.1 | C18.1 v54.36,67.82 C15.1 56.05,66.05 H2.B3,6 | v11.01,59.39 11.06,59.34 13.88,59.34 | 20.7,59.14 IC5.15 | UART0.4 23.55,9.73 35.84,9.73 36.7,10.59 JTAG.6 43.43,11.18 48.38,16.13 48.38,19.97 50.43,22.02 51.97,22.02 C12.- | v25.6,55.55 22.02,59.14 20.7,59.14 | 69.67,78.16 69.28,78.54 | GP2.12 56.96,76.21 v56.96,74.37 | GP2.9 52.74,76.68 v52.74,73.98 | GP2.6 48.9,76.75 v48.9,73.98 | v44.03,73.73 45.16,74.85 GP2.3
  Bottom 0.61: 69.67,78.16 SERVOS.9 | 69.67,78.16 69.47,78.36 | 65.92,78.37 SERVOS.6 65.92,75.05 66.29,74.68 C14.2 | C19.2 62.17,73.6 SERVOS.3 62.17,78.17 62.3,78.17 62.72,78.59 65.7,78.59 65.92,78.37 | J2.2 78.74,78.49 78.61,78.61 70.17,78.61 69.63,78.08 69.63,76.8 | 69.67,78.16 69.24,78.59 66.15,78.59 65.92,78.37
  Bottom 1.016: C11.- 91.69,20.49 D1.A | C13.- 70.96,15.65 D2.A
  other vias: 42.5,46.85 19.71,45.31 9.98,40.96
  pour Bottom: 0,-0.26 99.84,-0.26 99.84,80.13 0,80.13
  pour Top: 0,0 99.84,0 99.84,80.13 0,80.13
INT5  (via drill 0.6 pad 1.68)
  Top 0.305: IC3.7 30.21,41.89
  Top 0.406: 30.21,41.89 30.21,45.57 34.82,50.18 59.9,50.18 62.72,47.36 71.17,47.36 75.01,51.2 75.01,53.5 82.94,61.44 85.76,61.44 v90.75,56.45
  Bottom 0.406: I2C.2 94.11,59.8 v90.75,56.45
INT6  (via drill 0.6 pad 1.68)
  Top 0.305: IC3.8 29.44,41.92
  Top 0.406: 29.44,41.92 29.44,46.08 34.3,50.94 43.52,50.94 | 43.52,50.94 44.03,50.94 | v95.38,57.86 91.9,57.86 87.3,62.46 82.69,62.46 74.24,54.02 74.24,51.71 70.66,48.13 63.23,48.13 60.42,50.94 43.52,50.94
  Bottom 0.406: 95.38,57.76 v95.38,57.86 I2C.1
LED_COLOR_SENSOR0_3V
  Top 0.305: IC1.18 31.48,51.96 27.9,48.38
  Top 0.406: 27.9,48.38 26.62,48.38 19.97,41.73 19.97,39.42 20.16,39.24 IC3.18
LED_COLOR_SENSOR0_5V  (via drill 0.6 pad 1.68)
  Top 0.305: IC1.6 32.13,63.36
  Top 0.406: 32.13,63.36 v31.74,63.74
  Bottom 0.406: COLOR_SENSOR0.5 30.48,68.07 29.97,67.56 29.97,65.52 v31.74,63.74
LED_COLOR_SENSOR1_3V
  Top 0.305: IC1.17 30.83,52.34 27.65,49.15 26.88,49.15
  Top 0.406: IC3.19 21.12,38.4 19.71,38.4 18.94,39.17 18.94,41.98 26.11,49.15 26.88,49.15 27.39,49.15
LED_COLOR_SENSOR1_5V
  Top 0.305: IC1.7 31.48,60.68 31.23,60.93
  Top 0.406: COLOR_SENSOR1.5 9.98,69.67 9.98,64.26 8.45,62.72 8.45,59.14 10.76,56.83 23.8,56.83 28.93,61.95 29.7,61.95 30.21,61.95 31.23,60.93
N$1
  Top 0.406: IC3.23 14.64,35.24 Q1.2 12.09,37.78 C4.2
N$2
  Top 0.406: C5.2 12.61,31.31 Q1.1 15.73,34.44 IC3.24
N$3
  Top 0.406: IC3.47 34.16,25.24 46.08,13.31 49.15,13.31 51.56,10.9 R9.1
N$4
  Top 0.406: IC3.1 35.84,42.72 35.84,47.58 R3.2
N$5  (via drill 0.6 pad 1.68)
  Top 0.406: IC3.64 36.76,40.85 39.17,43.26 40.02,43.26 C8.1 40.13,45.25 v40.45,45.57
  Bottom 0.406: 41.47,41.14 L1.2 42.24,40.89 42.24,43.78 v40.45,45.57
N$6
  Top 0.406: IC3.62 41.77,38.44 C9.2
N$7
  Bottom 0.406: GP2.11 55.16,72.23 R15.2
N$8
  Top 1.016: IC2.2 82.88,25.54 79.36,22.02 76.56,22.02 D1.C
  Bottom 1.016: L2.2 78.36,20.22 D1.C
N$9
  Top 0.406: R4.1 94.09,24.8 R5.2 92.23,26.19 90.88,24.83 87.55,24.83 86.53,25.86 86.53,27.27 IC2.4
N$10
  Top 0.406: IC3.46 33.36,24.76 45.82,12.29 47.36,12.29 48.38,11.26 48.38,10.5 | 48.38,10.5 48.38,9.97 R8.1 | 48.38,10.5 48.38,11.01
N$11
  Top 1.016: IC4.2 59.52,21.63 56.83,18.94 53.23,18.94 D2.C
  Bottom 1.016: L3.2 55.76,15.62 D2.C
N$12
  Bottom 0.406: GP2.2 43.91,75.66 42.93,74.68 40.45,72.2 R13.2
N$13
  Bottom 0.406: R16.2 46.59,73.22 47.66,74.28 GP2.5
N$14
  Top 0.406: PUISS_AX12.A 94.2,35.32 R2.1
N$15
  Bottom 0.406: R14.2 51.41,72.58 GP2.8
N$17
  Top 0.406: IC3.45 32.51,26.19 32.51,24.32 32.51,24.06 45.47,11.11 R7.1
N$18
  Top 0.406: PA4.A R9.2
N$19
  Top 0.406: PA5.A R8.2
N$20
  Top 0.406: PA6.A R7.2
N$21
  Top 0.406: PA7.A R6.2
N$22
  Top 0.406: IC3.44 31.74,26.22 31.74,23.04 42.16,12.62 R6.1
RX0  (via drill 0.6 pad 1.68)
  Top 0.406: IC3.2 34.16,45.97 v33.54,46.59
  Bottom 0.406: v33.54,46.59 33.92,46.21 33.92,44.16 31.23,41.47 26.37,41.47 17.66,50.18 4.1,50.18 3.33,49.41 3.33,21.76 6.14,18.94 11.78,18.94 17.15,13.57 UART0.2
SCL  (via drill 0.6 pad 1.68)
  Top 0.406: v83.71,59.9 83.71,58.62 71.42,46.34 58.62,46.34 v58.11,46.85 | IC3.25 18.02,33.64 14.85,30.46 14.85,25.34 v14.59,25.09
  Bottom 0.406: R11.2 90.3,69.03 I2C.5 90.3,62.1 88.1,59.9 v83.71,59.9 | v14.59,25.09 14.08,24.58 14.08,22.02 16.13,19.97 20.48,19.97 21.76,21.25 36.1,21.25 58.11,43.26 v58.11,46.85
SDA  (via drill 0.6 pad 1.68)
  Top 0.406: v85.5,58.37 72.45,45.31 56.06,45.31 v55.81,45.06 | IC3.26 18.76,32.84 16.38,30.46 16.38,24.83 15.62,24.06 v15.62,23.04
  Bottom 0.406: R10.2 93.47,68.71 I2C.4 91.57,61.85 88.09,58.37 v85.5,58.37 | v15.62,23.04 15.62,22.02 16.64,20.99 20.22,20.99 21.5,22.27 35.84,22.27 36.86,23.3 55.81,42.24 v55.81,45.06
SELECT_COLOR_SENSOR_OUTPUT  (via drill 0.6 pad 1.68)
  Top 0.406: IC3.38 26.96,24.4 23.04,20.48 14.08,20.48 6.14,28.42 6.14,54.78 7.17,55.81 19.46,55.81 21.38,53.89 | 21.38,53.89 22.02,53.25 v22.27,53.25 | 21.38,53.89 20.99,54.27
  Bottom 0.406: v22.27,53.25 21.97,53.55 IC5.1
SERVO_ANA0_3V
  Top 0.305: IC1.20 32.78,50.7 28.67,46.59
  Top 0.406: IC3.15 23.76,42.96 27.39,46.59 28.67,46.59
SERVO_ANA0_5V  (via drill 0.6 pad 1.68)
  Top 0.305: IC1.4 33.43,61.34 35.33,63.23
  Top 0.406: 35.33,63.23 44.8,63.23 46.57,65.01 58.64,65.01 v60.45,66.82
  Bottom 0.406: SERVOS.2 60.92,74.64 60.45,74.17 v60.45,66.82
SERVO_ANA1_3V
  Top 0.305: IC1.19 32.13,51.33 28.42,47.62
  Top 0.406: IC3.16 22.96,43.44 27.14,47.62 28.42,47.62
SERVO_ANA1_5V  (via drill 0.6 pad 1.68)
  Top 0.305: IC1.5 32.78,61.97 34.82,64
  Top 0.406: 34.82,64 35.07,64.26 44.54,64.26 46.08,65.79 56.83,65.79 59.76,68.72 v63.64,68.72
  Bottom 0.406: SERVOS.5 64.67,74.52 65.02,74.17 65.02,70.1 v63.64,68.72
TCK  (via drill 0.6 pad 1.68)
  Top 0.406: IC3.57 45.18,34.44 47.62,32 47.62,24.83 v47.87,25.09
  Bottom 0.406: JTAG.2 31.62,14.73 34.05,17.15 40.19,17.15 46.34,23.3 v47.87,25.09
TDI  (via drill 0.6 pad 1.68)
  Top 0.406: IC3.54 42.2,32.04 43.01,31.23 43.01,19.71 v45.31,16.64
  Bottom 0.406: JTAG.5 42.39,13.72 v45.31,16.64
TDO  (via drill 0.6 pad 1.68)
  Top 0.406: IC3.55 42.94,32.84 44.54,31.23 44.54,20.22 45.82,18.94 v46.34,18.94
  Bottom 0.406: JTAG.4 34.16,14.45 34.82,15.1 41.22,15.1 45.06,18.94 v46.34,18.94
TMS  (via drill 0.6 pad 1.68)
  Top 0.406: IC3.56 43.68,33.64 46.08,31.23 46.08,22.78 v47.36,21.5
  Bottom 0.406: JTAG.3 32.89,14.46 34.56,16.13 40.96,16.13 46.34,21.5 v47.36,21.5
TX0  (via drill 0.6 pad 1.68)
  Top 0.406: IC3.3 33.28,41.91 33.28,43.26 v32,44.54
  Bottom 0.406: UART0.3 18.41,9.71 17.41,8.7 14.59,8.7 2.3,20.99 2.3,49.66 3.84,51.2 18.18,51.2 26.88,42.5 29.95,42.5 v32,44.54

### Text on the board
Top: top | MECA 2k10 | rob'otter
Bottom: bot
Dimension: un calque pour les aligner tous